# Altium schematic sheet FOTA MicroController Block Diagram.SchDoc: FOTA MicroController Block Diagram
size 292 x 193 mm; SheetNumber: 29; SheetTotal: 50
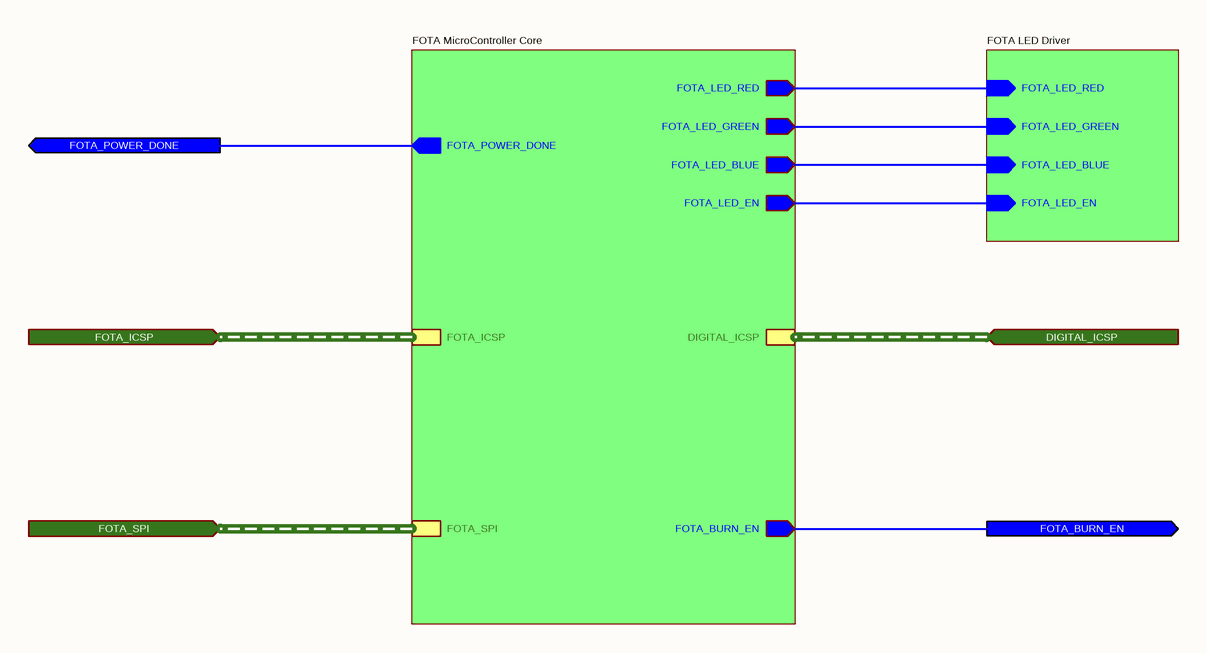
[diagram p0: FOTA MicroController Block Diagram.SchDoc]

## Sub-sheets
FOTA LED Driver = FOTA LED Driver.SchDoc: FOTA_LED_RED (in), FOTA_LED_EN (in), FOTA_LED_BLUE (in), FOTA_LED_GREEN (in)
FOTA MicroController Core = FOTA MicroController Core.SchDoc: FOTA_LED_BLUE (out), FOTA_LED_GREEN (out), FOTA_LED_EN (out), FOTA_POWER_DONE (out), FOTA_LED_RED (out), FOTA_BURN_EN (out), FOTA_SPI (harness FOTA_SPI), DIGITAL_ICSP (harness DIGITAL_ICSP), FOTA_ICSP (harness FOTA_ICSP)

## Ports
DIGITAL_ICSP (in, harness DIGITAL_ICSP), FOTA_BURN_EN (out), FOTA_ICSP (in, harness FOTA_ICSP), FOTA_POWER_DONE (out), FOTA_SPI (in, harness FOTA_SPI)

## Nets
FOTA_BURN_EN: port FOTA_BURN_EN, sheet FOTA MicroController Core/FOTA_BURN_EN
FOTA_POWER_DONE: port FOTA_POWER_DONE, sheet FOTA MicroController Core/FOTA_POWER_DONE
(unnamed): sheet FOTA MicroController Core/FOTA_LED_BLUE, sheet FOTA LED Driver/FOTA_LED_BLUE
(unnamed): sheet FOTA MicroController Core/FOTA_LED_GREEN, sheet FOTA LED Driver/FOTA_LED_GREEN
(unnamed): sheet FOTA MicroController Core/FOTA_LED_EN, sheet FOTA LED Driver/FOTA_LED_EN
(unnamed): sheet FOTA MicroController Core/FOTA_LED_RED, sheet FOTA LED Driver/FOTA_LED_RED

## Buses and harness runs
harness port DIGITAL_ICSP = sheet FOTA MicroController Core/DIGITAL_ICSP
harness port FOTA_ICSP = sheet FOTA MicroController Core/FOTA_ICSP
harness port FOTA_SPI = sheet FOTA MicroController Core/FOTA_SPI

## Notes on the sheet
- © 2021 All rights reserved.
  This document may not, in whole or in part, be copied, photocopied, reproduced, translated or converted to any electronic or machine readable from without prior written permission of Mehmet Günce Akkoyun.
  Engineer contact : akkoyun@me.com
- Property of
- Engineer :
- Date :
- Size :
- A4
- Time :
- Project :
- Page :
- /
- Customer :
- Product ID :
- Module ID :
- Version :
- File :
- Revision :